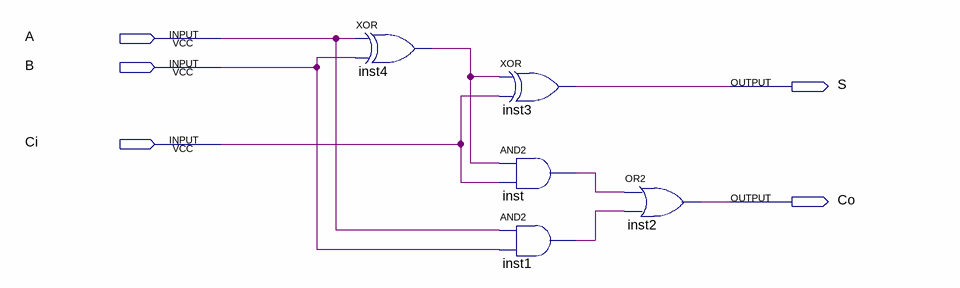
[diagram p0: schematic sheet]
// Quartus schematic 1b_FullAdder.bdf as structural Verilog: 5 symbols, 5 pins
module \1b_FullAdder  (
  input  A,
  input  B,
  input  Ci,
  output S,
  output Co
);

  wire inst1_out, inst4_out, inst_out;

  xor inst4 (inst4_out, A, B);
  xor inst3 (S, inst4_out, Ci);
  and inst (inst_out, inst4_out, Ci);
  and inst1 (inst1_out, A, B);
  or inst2 (Co, inst_out, inst1_out);
endmodule
